# EAGLE design G-PIC Lite v1.2 (EAGLE 6.2)
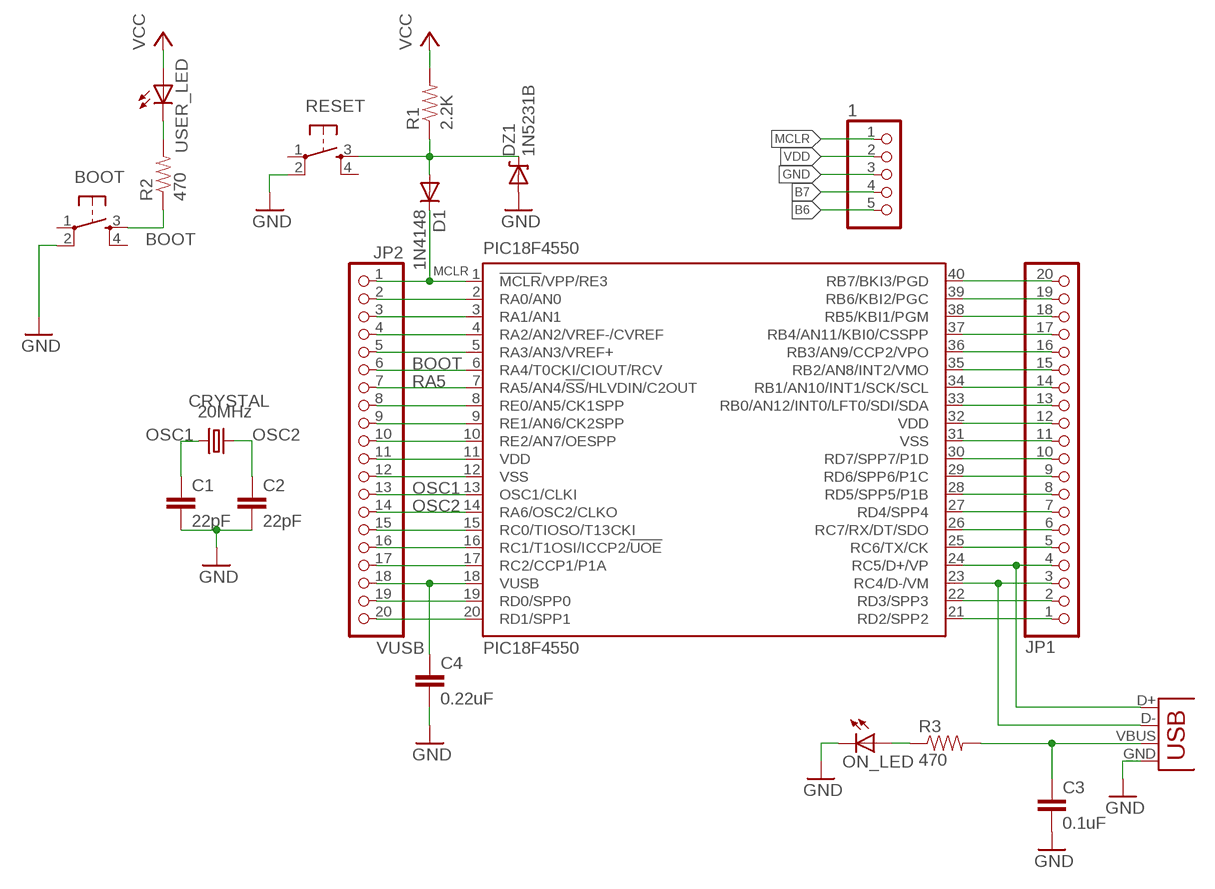
[diagram p0: schematic, sheet 1]

## Parts
1  PINHD-1X5  [1X05]
BOOT  TAC_SWITCHPTH  [TACTILE-PTH]
C1  22pF  C5/3  [C5B3]
C2  22pF  C5/3  [C5B3]
C3  0.1uF  C2,5-3  [C2.5-3]
C4  0.22uF  C5/3  [C5B3]
CRYSTAL  20MHz  CRYSTALHC49US  [HC49US]
D1  1N4148  DIODE-D-5  [D-5]
DZ1  1N5231B  DIODE-ZENERPTH  [DIODE-ZENER]
JP1  PINHD-1X20  [1X20]
JP2  PINHD-1X20  [1X20]
ON_LED  LED3MM  [LED3MM]
PIC18F4550  PIC18F4550  PIC18F4550_40  [DIL40]
R1  2.2K  RESISTORPTH-1/4W  [AXIAL-0.4]
R2  470  RESISTORPTH-1/4W  [AXIAL-0.4]
R3  470  RESISTORPTH-1/4W  [AXIAL-0.4]
RESET  TAC_SWITCHPTH  [TACTILE-PTH]
USB  X1  USBPTH  [USB-B-PTH]
USER_LED  LED3MM  [LED3MM]

## Nets
B6: 1.5 JP1.19 PIC18F4550.39(RB6/KBI2/PGC)
B7: 1.4 JP1.20 PIC18F4550.40(RB7/BKI3/PGD)
BOOT: BOOT.3 JP2.6 PIC18F4550.6(RA4/T0CKI/CIOUT/RCV) R2.P$1
D+: JP1.4 PIC18F4550.24(RC5/D+/VP) USB.D+
D-: JP1.3 PIC18F4550.23(RC4/D-/VM) USB.D-
GND: 1.3 BOOT.2 C1.2 C2.2 C3.2 C4.2 DZ1.P$2(A) JP1.11 JP2.12 ON_LED.K(C) PIC18F4550.12(VSS) PIC18F4550.31(VSS) RESET.2 USB.GND
MCLR: 1.1 D1.C JP2.1 PIC18F4550.1(!MCLR!/VPP/RE3)
N$1: JP1.1 PIC18F4550.21(RD2/SPP2)
N$2: JP1.2 PIC18F4550.22(RD3/SPP3)
N$3: R2.P$2 USER_LED.K(C)
N$5: JP1.5 PIC18F4550.25(RC6/TX/CK)
N$6: JP1.6 PIC18F4550.26(RC7/RX/DT/SDO)
N$7: JP1.7 PIC18F4550.27(RD4/SPP4)
N$8: JP1.8 PIC18F4550.28(RD5/SPP5/P1B)
N$9: JP1.9 PIC18F4550.29(RD6/SPP6/P1C)
N$10: JP1.10 PIC18F4550.30(RD7/SPP7/P1D)
N$12: ON_LED.A R3.P$1
N$13: JP1.13 PIC18F4550.33(RB0/AN12/INT0/LFT0/SDI/SDA)
N$14: JP1.14 PIC18F4550.34(RB1/AN10/INT1/SCK/SCL)
N$15: JP1.15 PIC18F4550.35(RB2/AN8/INT2/VMO)
N$16: JP1.16 PIC18F4550.36(RB3/AN9/CCP2/VPO)
N$17: JP1.17 PIC18F4550.37(RB4/AN11/KBI0/CSSPP)
N$18: JP1.18 PIC18F4550.38(RB5/KBI1/PGM)
N$20: D1.A DZ1.P$1(C) R1.P$1 RESET.3
N$22: JP2.2 PIC18F4550.2(RA0/AN0)
N$23: JP2.3 PIC18F4550.3(RA1/AN1)
N$24: JP2.4 PIC18F4550.4(RA2/AN2/VREF-/CVREF)
N$25: JP2.5 PIC18F4550.5(RA3/AN3/VREF+)
N$28: JP2.8 PIC18F4550.8(RE0/AN5/CK1SPP)
N$29: JP2.9 PIC18F4550.9(RE1/AN6/CK2SPP)
N$30: JP2.10 PIC18F4550.10(RE2/AN7/OESPP)
N$35: JP2.15 PIC18F4550.15(RC0/TIOSO/T13CKI)
N$36: JP2.16 PIC18F4550.16(RC1/T1OSI/ICCP2/!UOE)
N$37: JP2.17 PIC18F4550.17(RC2/CCP1/P1A)
N$39: JP2.19 PIC18F4550.19(RD0/SPP0)
N$40: JP2.20 PIC18F4550.20(RD1/SPP1)
OSC1: C1.1 CRYSTAL.2 JP2.13 PIC18F4550.13(OSC1/CLKI)
OSC2: C2.1 CRYSTAL.1 JP2.14 PIC18F4550.14(RA6/OSC2/CLKO)
RA5: JP2.7 PIC18F4550.7(RA5/AN4/!SS!/HLVDIN/C2OUT)
VDD: 1.2 C3.1 JP1.12 JP2.11 PIC18F4550.11(VDD) PIC18F4550.32(VDD) R1.P$2 R3.P$2 USB.VBUS USER_LED.A ; supply symbol labelled VCC
VUSB: C4.1 JP2.18 PIC18F4550.18(VUSB)
Unconnected: BOOT.1 BOOT.4 RESET.1 RESET.4

## Library data of the parts
1 = pinhead:PINHD-1X5: PIN HEADER
BOOT RESET = SparkFun:TAC_SWITCH: Momentary Switch Button commonly used for reset or general input. Spark Fun Electronics SKU : COM-00097
C1-C4 = capacitor-wima:C: CAPACITOR naming: grid - package width
CRYSTAL = SparkFun:CRYSTAL: Crystals Various standard crystals. Proven footprints. Spark Fun Electronics SKU : COM-00534
D1 = diode:DIODE-: DIODE
DZ1 = SparkFun-DiscreteSemi:DIODE-ZENER: Zener Diode Production Part - 8199 3.4V Zener Voltage
JP1 JP2 = adafruit:PINHD-1X20: PIN HEADER
ON_LED USER_LED = adafruit:LED: LED OSRAM: - CHIPLED LG R971, LG N971, LY N971, LG Q971, LY Q971, LO R971, LY R971 LH N974, LH R974 LS Q976, LO Q976, LY Q976 LO Q996 - Hyper CHIPLED LW Q18S LB Q993, LB Q99A, LB R99A - SideLED LS A670, LO A670, LY A670, LG A670, LP A670 LB A673, LV A673, LT A673, LW A673 LH A674 LY A675 LS A676, LA A676, LO A676, LY A676, LW A676 LS A679, LY A679, LG A679 - Hyper Micro SIDELED® LS Y876, LA Y876, LO Y876, LY Y876 LT Y87S - SmartLED LW L88C, LW L88S LB L89C, LB L89S, LG L890 LS L89K, LO L89K, LY L89K LS L896, LA L896, LO L896, LY L896 - TOPLED LS T670, LO T670, LY T670, LG T670, LP T670 LSG T670, LSP T670, LSY T670, LOP T670, LYG T670 LG T671, LOG T671, LSG T671 LB T673, LV T673, LT T673, LW T673 LH T674 LS T676, LA T676, LO T676, LY T676, LB T676, LH T676, LSB T676, LW T676 LB T67C, LV T67C, LT T67C, LS T67K, LO T67K, LY T67K, LW E67C LS E67B, LA E67B, LO E67B, LY E67B, LB E67C, LV E67C, LT E67C LW T67C LS T679, LY T679, LG T679 LS T770, LO T770, LY T770, LG T770, LP T770 LB T773, LV T773, LT T773, LW T773 LH T774 LS E675, LA E675, LY E675, LS T675 LS T776, LA T776, LO T776, LY T776, LB T776 LHGB T686 LT T68C, LB T68C - Hyper Mini TOPLED® LB M676 - Mini TOPLED Santana® LG M470 LS M47K, LO M47K, LY M47K Source: http://www.osram.convergy.de/
PIC18F4550 = microchip:PIC18F4*_40: USB Microcontrollers with nanoWatt Technology High-Performance, Enhanced Flash, 28/40/44-Pin, Source: http://ww1.microchip.com/downloads/en/devicedoc/39632c.pdf; MF: MICROCHIP; MPN: PIC18F4550-I/P; OC_FARNELL: 9321357; OC_NEWARK: 74K8623
R1-R3 = SparkFun:RESISTOR: Resistor Basic schematic elements and footprints for 0603, 1206, and PTH resistors.
USB = SparkFun:USB: USB Connectors USB-B-PTH is fully proven SKU : PRT-00139 USB-miniB is fully proven SKU : PRT-00587 USB-A-PCB is untested. USB-A-H is throughly reviewed, but untested. Spark Fun Electronics SKU : PRT-00437 USB-B-SMT is throughly reviewed, but untested. Needs silkscreen touching up. USB-A-S has not been used/tested USB-MB-H has not been used/tested

## Board
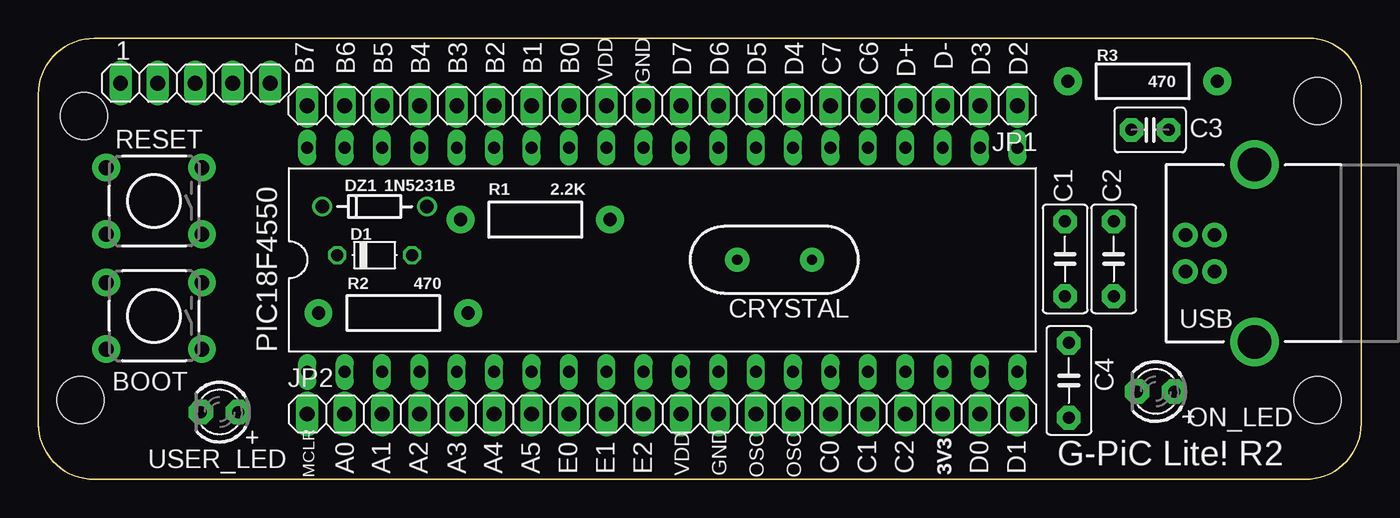
[diagram p1: board, top side]
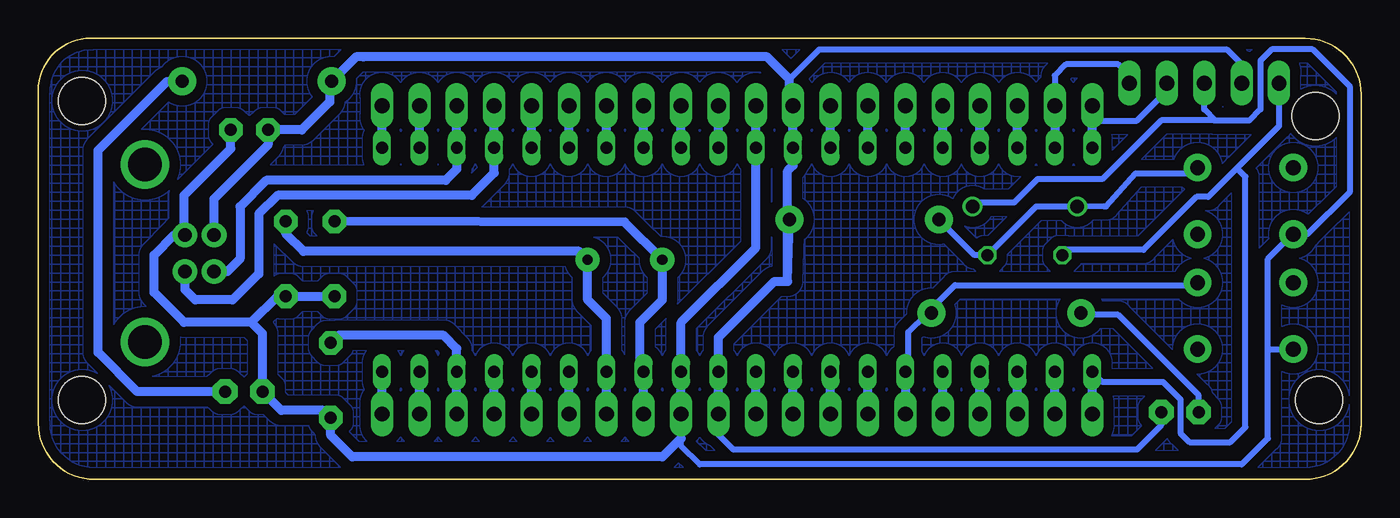
[diagram p2: board, bottom side, seen from below]

Size 89.92 x 29.97 mm. Coordinates in mm from the lower left corner, seen from the top.
Outline: 0,3.81 0,26.16 arc-90 3.81,29.97 86.36,29.97 arc-90 89.92,26.42 89.92,3.81 arc-90 86.11,0 3.81,0 arc-90 0,3.81
Outline: 0,3.81 0,3.56
Copper layers (1*16): Top 0.0356mm / dielectric 1.5011mm / Bottom 0.0356mm
Design rules "ArduinoShield Rules *": minimum track width 16mil, minimum drill 13mil, track to track 0.7mm, track to pad 0.7mm, pad to pad 0.3mm, via to via 0.7mm, smd to smd 6mil, copper to edge 15mil, drill to drill 6mil, minimum pad ring 7mil, minimum via ring 7mil, stop-mask expansion 4mil, vias tented up to drill 0mil, thermal gap 10mil
Holes 3.2 mm at 3.11,24.7 2.86,5.4 86.93,5.4 86.93,25.72

### Footprints (pad centres in the part's own frame; a part is rotated, then mirrored left to right if it is on the bottom)
1X05 = drill 1.016 long: 1 -5.08,0; 2 -2.54,0; 3 0,0; 4 2.54,0; 5 5.08,0
TACTILE-PTH = drill 1.016 pad 1.88: 1 -3.251,2.261; 2 3.251,2.261; 3 -3.251,-2.261; 4 3.251,-2.261
C5B3 = drill 0.813 pad 1.6 octagon: 1 -2.54,0; 2 2.54,0
C2.5-3 = drill 0.813 pad 1.6 octagon: 1 -1.27,0; 2 1.27,0
HC49US = drill 0.7 pad 1.651: 1 -2.54,0; 2 2.54,0
D-5 = drill 0.813 octagon: A 2.54,0; C -2.54,0
DIODE-ZENER = drill 0.9: P$1 -3.556,0; P$2 3.556,0
1X20 = drill 1.016 long: 1 -24.13,0; 2 -21.59,0; 3 -19.05,0; 4 -16.51,0; 5 -13.97,0; 6 -11.43,0; 7 -8.89,0; 8 -6.35,0; 9 -3.81,0; 10 -1.27,0; 11 1.27,0; 12 3.81,0; 13 6.35,0; 14 8.89,0; 15 11.43,0; 16 13.97,0; 17 16.51,0; 18 19.05,0; 19 21.59,0; 20 24.13,0
LED3MM = drill 0.813 pad 1.676 octagon: A -1.27,0; K 1.27,0
DIL40 = drill 0.813 long: 1 -24.13,-7.62; 2 -21.59,-7.62; 3 -19.05,-7.62; 4 -16.51,-7.62; 5 -13.97,-7.62; 6 -11.43,-7.62; 7 -8.89,-7.62; 8 -6.35,-7.62; 9 -3.81,-7.62; 10 -1.27,-7.62; 11 1.27,-7.62; 12 3.81,-7.62; 13 6.35,-7.62; 14 8.89,-7.62; 15 11.43,-7.62; 16 13.97,-7.62; 17 16.51,-7.62; 18 19.05,-7.62; 19 21.59,-7.62; 20 24.13,-7.62; 21 24.13,7.62; 22 21.59,7.62; 23 19.05,7.62; 24 16.51,7.62; 25 13.97,7.62; 26 11.43,7.62; 27 8.89,7.62; 28 6.35,7.62; 29 3.81,7.62; 30 1.27,7.62; 31 -1.27,7.62; 32 -3.81,7.62; 33 -6.35,7.62; 34 -8.89,7.62; 35 -11.43,7.62; 36 -13.97,7.62; 37 -16.51,7.62; 38 -19.05,7.62; 39 -21.59,7.62; 40 -24.13,7.62
AXIAL-0.4 = drill 0.9 pad 1.88: P$1 -5.08,0; P$2 5.08,0
USB-B-PTH = drill 0.914 pad 1.676: D+ 0,1.25; D- 1.981,1.25; GND 0,-1.25; VBUS 1.981,-1.25 | drill 2.286: S1 -2.718,-6.02; S2 -2.718,6.02

### Placement (x,y rotation side)
1  10.67,26.92 0 top
BOOT  7.87,11.11 180 top
C1  69.79,14.99 270 top
C2  73.09,14.99 270 top
C3  75.56,23.75 0 top
C4  70.04,6.73 270 top
CRYSTAL  50.04,14.92 180 top
D1  22.86,15.24 0 top
DZ1  22.86,18.54 0 top
JP1  42.42,25.4 180 top
JP2  42.42,4.45 0 top
ON_LED  75.95,5.97 180 top
PIC18F4550  42.42,14.92 0 top
R1  33.78,17.65 0 top
R2  24.13,11.3 180 top
R3  75.06,27.05 180 top
RESET  7.87,18.92 180 top
USB  79.95,15.37 180 top
USER_LED  12.32,4.57 180 top

### Tracks (layer width: path | path; a pad name or v marks a point on that pad's centre or on a via)
B6
  Bottom 0.406: 1.5 15.49,27.18 16.51,28.19 20.07,28.19 20.83,27.43 JP1.19
  Bottom 0.6: JP1.19 PIC18F4550.39
B7
  Bottom 0.406: 1.4 12.95,26.67 15.24,24.38 18.29,24.38
  Bottom 0.6: PIC18F4550.40 18.29,24.38 JP1.20
BOOT
  Bottom 0.406: BOOT.3 11.2,13.2 27.6,13.2 29.2,11.6 R2.P$1 29.6,11.2 30.8,10 30.8,7.6 PIC18F4550.6
  Bottom 0.6: PIC18F4550.6 JP2.6
D+
  Bottom 0.6: USB.D+ 79.95,12.89 79.25,12.19 76.71,12.19 74.93,13.97 74.93,18.03 73.66,19.3 60.45,19.3 58.93,20.83 PIC18F4550.24 JP1.4
D-
  Bottom 0.6: USB.D- 77.07,14.12 76.2,14.99 76.2,18.54 74.42,20.32 62.23,20.32 61.47,21.08 PIC18F4550.23 JP1.3
GND
  Bottom 0.406: 6.35,8.89 6.35,2.79 8.13,1.02 44.96,1.02 46.23,2.29 46.23,2.79 JP2.12 | 6.35,8.89 6.35,14.99 4.67,16.66 RESET.2 3.66,16.66 0.76,19.56 0.76,26.67 3.3,29.21 6.1,29.21 6.86,28.45 6.86,25.15 7.62,24.38 9.91,24.38 | 1.3 10.67,25.15 9.91,24.38 | BOOT.2 6.31,8.85 6.35,8.89 | 9.91,24.38 10,24.4 13.6,24.4 17.6,20.4 22,20.4 23.6,18.8 26.16,18.8 DZ1.P$2
  Bottom 0.6: JP2.12 PIC18F4550.12 46.23,10.67 41.15,15.75 PIC18F4550.31 JP1.11
  Bottom 0.61: 75.44,10.67 73.66,12.45 C2.2 C1.2 | 75.44,10.67 80.01,10.67 82.04,12.7 82.04,15.24 80.67,16.62 USB.GND 80.01,16.68 80.01,19.3 76.83,22.48 C3.2 | 75.44,10.67 74.68,9.91 ON_LED.K 73.41,4.7 70.55,4.7 C4.2 70.04,2.98 68.58,1.52 47.5,1.52 46.23,2.79
MCLR
  Bottom 0.406: 8.45,21.15 5.6,24 5.6,26.8 1.1 | 8.45,21.15 10.4,19.2 11.2,19.2 14.8,15.6 20,15.6 D1.C | 8.45,21.15 7.87,20.57 7.87,3.56 8.89,2.54 11.68,2.54 12.29,3.15 12.29,5.43 13.46,6.6 17.59,6.6 PIC18F4550.1
  Bottom 0.6: JP2.1 PIC18F4550.1
N$1
  Bottom 0.6: PIC18F4550.21 JP1.1
N$2
  Bottom 0.6: PIC18F4550.22 JP1.2
N$3
  Bottom 0.406: USER_LED.K 11.05,5.71 16.51,11.18 18.92,11.18 R2.P$2
N$4
  Bottom 0.1: 0,3.81 arc90 3.81,0 86.11,0 arc90 89.92,3.81 89.92,26.42 arc90 86.36,29.97 3.81,29.97 arc90 0,26.16 0,3.81
N$5
  Bottom 0.6: PIC18F4550.25 JP1.5
N$6
  Bottom 0.6: PIC18F4550.26 JP1.6
N$7
  Bottom 0.6: PIC18F4550.27 JP1.7
N$8
  Bottom 0.6: PIC18F4550.28 JP1.8
N$9
  Bottom 0.6: PIC18F4550.29 JP1.9
N$10
  Bottom 0.6: PIC18F4550.30 JP1.10
N$11
  pour Bottom (isolate 0.406, hatched): 0,6.1 0,3.81 arc90 3.81,0 86.11,0 arc90 89.92,3.81 89.92,26.42 arc90 86.36,29.97 3.81,29.97 arc90 0,26.16
N$12
  Bottom 0.6: ON_LED.A 82.42,5.97
  Bottom 0.61: 82.42,5.97 83.19,5.97 85.85,8.64 85.85,22.35 81.15,27.05 R3.P$1
N$13
  Bottom 0.6: PIC18F4550.33 JP1.13
N$14
  Bottom 0.6: PIC18F4550.34 JP1.14
N$15
  Bottom 0.6: PIC18F4550.35 JP1.15
N$16
  Bottom 0.6: PIC18F4550.36 JP1.16
N$17
  Bottom 0.6: PIC18F4550.37 JP1.17
N$18
  Bottom 0.6: PIC18F4550.38 JP1.18
N$20
  Bottom 0.406: RESET.3 11.2,20.8 15.35,20.8 17.35,18.55 17.46,18.55 DZ1.P$1 22.1,18.54 D1.A 26.29,15.24 R1.P$1
N$22
  Bottom 0.6: JP2.2 PIC18F4550.2
N$23
  Bottom 0.6: JP2.3 PIC18F4550.3
N$24
  Bottom 0.6: JP2.4 PIC18F4550.4
N$25
  Bottom 0.6: JP2.5 PIC18F4550.5
N$28
  Bottom 0.6: JP2.8 PIC18F4550.8
N$29
  Bottom 0.6: JP2.9 PIC18F4550.9
N$30
  Bottom 0.6: JP2.10 PIC18F4550.10
N$35
  Bottom 0.6: JP2.15 PIC18F4550.15
N$36
  Bottom 0.6: JP2.16 PIC18F4550.16
N$37
  Bottom 0.6: JP2.17 PIC18F4550.17
N$39
  Bottom 0.6: JP2.19 PIC18F4550.19
N$40
  Bottom 0.6: JP2.20 PIC18F4550.20
OSC1
  Bottom 0.6: C1.1 50.06,17.49 CRYSTAL.2 47.5,12.19 49.02,10.67 49.02,7.56 PIC18F4550.13 JP2.13
OSC2
  Bottom 0.6: C2.1 73.09,16.7 71.88,15.49 53.15,15.49 CRYSTAL.1 52.58,12.19 51.31,10.92 PIC18F4550.14 JP2.14
RA5
  Bottom 0.6: JP2.7 PIC18F4550.7
VDD
  Bottom 0.406: 1.2 8.13,28.19 9.14,29.21 36.83,29.21 38.86,27.18 | USER_LED.A 13.59,3.68 15.24,2.03 42.67,2.03 43.69,3.05 JP2.11
  Bottom 0.6: PIC18F4550.32 JP1.12 38.86,25.65 38.86,27.18 40.39,28.7 67.82,28.7 | 39.88,13.46 43.69,9.65 PIC18F4550.11 JP2.11
  Bottom 0.61: 67.82,28.7 68.33,28.7 R3.P$2 70.1,26.92 70.1,25.65 72.01,23.75 C3.1 74.3,22.73 77.98,19.05 USB.VBUS | 39.88,13.46 38.99,13.46 | 38.99,13.46 R1.P$2 | 38.99,13.46 38.99,20.95 38.61,21.34 PIC18F4550.32
VUSB
  Bottom 0.6: 62.36,9.78 61.47,8.89 PIC18F4550.18 JP2.18
  Bottom 0.61: 62.36,9.78 69.53,9.78 C4.1

### Text on the board
tNames: B7 | B6 | B5 | B4 | B3 | B2 | B1 | B0 | VDD | GND | D7 | D6 | D5 | D4 | C7 | C6 | D+ | D- | D3 | D2 | PIC18F4550 | G-PiC Lite! R2 | MCLR | A0 | A1 | A2 | A3 | A4 | A5 | E0 | E1 | E2 | VDD | GND | OSC | OSC | C0 | C1 | C2 | 3V3 | D0 | D1